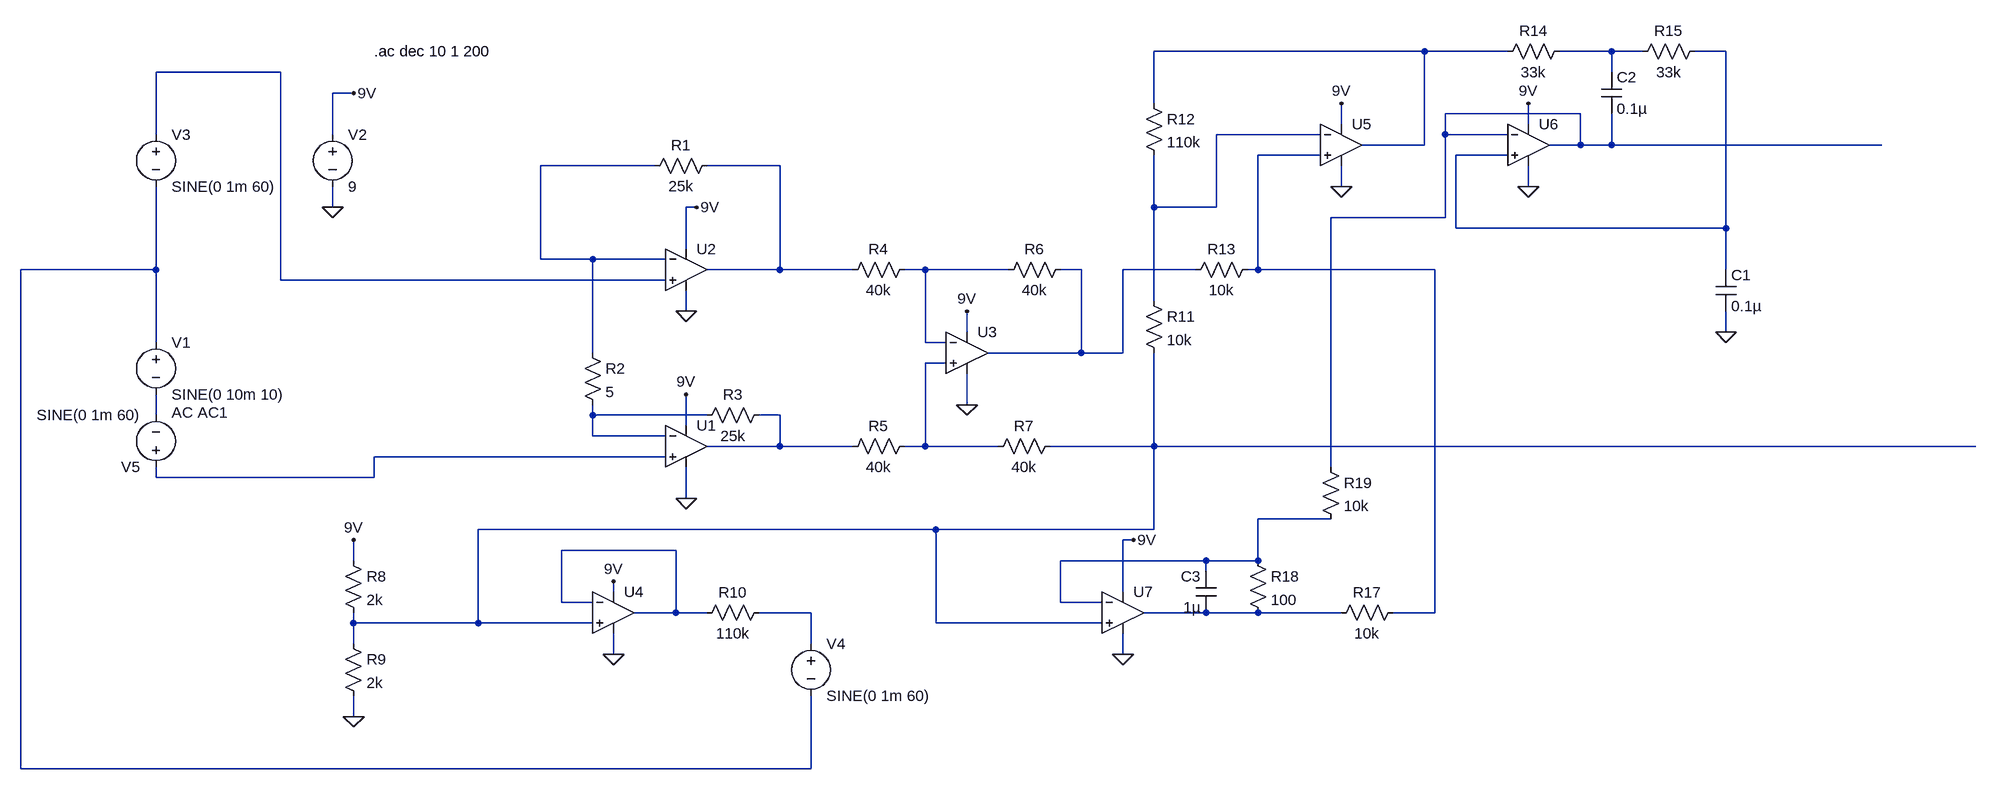
[diagram p0: schematic EEGSim.asc]
EEGSim.asc, the LTspice schematic file:
Version 4
SHEET 1 2068 868
WIRE 1216 -240 800 -240
WIRE 1344 -240 1216 -240
WIRE 1504 -240 1424 -240
WIRE 1552 -240 1504 -240
WIRE 1680 -240 1632 -240
WIRE -544 -208 -736 -208
WIRE 1504 -208 1504 -240
WIRE -432 -176 -464 -176
WIRE 800 -160 800 -240
WIRE 1456 -144 1248 -144
WIRE 1088 -128 1088 -160
WIRE 1376 -128 1376 -160
WIRE -736 -112 -736 -208
WIRE -464 -112 -464 -176
WIRE 1056 -112 896 -112
WIRE 1248 -112 1248 -144
WIRE 1344 -112 1248 -112
WIRE 1216 -96 1216 -240
WIRE 1216 -96 1120 -96
WIRE 1456 -96 1456 -144
WIRE 1456 -96 1408 -96
WIRE 1504 -96 1504 -144
WIRE 1504 -96 1456 -96
WIRE 1920 -96 1504 -96
WIRE 1056 -80 960 -80
WIRE 1344 -80 1264 -80
WIRE 32 -64 -144 -64
WIRE 224 -64 112 -64
WIRE 1088 -32 1088 -64
WIRE 1376 -32 1376 -64
WIRE -464 0 -464 -32
WIRE 96 0 80 0
WIRE 800 0 800 -80
WIRE 896 0 896 -112
WIRE 896 0 800 0
WIRE 1248 16 1248 -112
WIRE 1248 16 1072 16
WIRE 1264 32 1264 -80
WIRE 1680 32 1680 -240
WIRE 1680 32 1264 32
WIRE 80 64 80 0
WIRE -144 80 -144 -64
WIRE -64 80 -144 80
WIRE 48 80 -64 80
WIRE -736 96 -736 -32
WIRE -736 96 -944 96
WIRE 224 96 224 -64
WIRE 224 96 112 96
WIRE 336 96 224 96
WIRE 448 96 416 96
WIRE 576 96 448 96
WIRE 688 96 656 96
WIRE 864 96 752 96
WIRE 960 96 960 -80
WIRE 960 96 944 96
WIRE 1232 96 960 96
WIRE 1680 96 1680 32
WIRE -544 112 -544 -208
WIRE 48 112 -544 112
WIRE 800 144 800 0
WIRE 80 160 80 128
WIRE 512 192 512 160
WIRE 1680 192 1680 160
WIRE -736 208 -736 96
WIRE 448 208 448 96
WIRE 480 208 448 208
WIRE -64 224 -64 80
WIRE 688 224 688 96
WIRE 688 224 544 224
WIRE 752 224 752 96
WIRE 752 224 688 224
WIRE 480 240 448 240
WIRE 512 304 512 256
WIRE -736 320 -736 288
WIRE -64 320 -64 304
WIRE 112 320 -64 320
WIRE 224 320 192 320
WIRE 80 336 80 288
WIRE -64 352 -64 320
WIRE 48 352 -64 352
WIRE 224 368 224 320
WIRE 224 368 112 368
WIRE 336 368 224 368
WIRE 448 368 448 240
WIRE 448 368 416 368
WIRE 560 368 448 368
WIRE 800 368 800 224
WIRE 800 368 640 368
WIRE 2064 368 800 368
WIRE 48 384 -400 384
WIRE 1072 400 1072 16
WIRE -736 416 -736 400
WIRE -400 416 -400 384
WIRE -400 416 -736 416
WIRE 80 448 80 400
WIRE 1072 480 960 480
WIRE 464 496 -240 496
WIRE 800 496 800 368
WIRE 800 496 464 496
WIRE 768 512 752 512
WIRE 64 528 -112 528
WIRE -432 544 -432 512
WIRE 880 544 656 544
WIRE 960 544 960 480
WIRE 960 544 880 544
WIRE 880 560 880 544
WIRE -32 592 -32 576
WIRE 752 592 752 512
WIRE -112 608 -112 528
WIRE -64 608 -112 608
WIRE 656 608 656 544
WIRE 720 608 656 608
WIRE 64 624 64 528
WIRE 64 624 0 624
WIRE 112 624 64 624
WIRE 272 624 192 624
WIRE 880 624 784 624
WIRE 960 624 880 624
WIRE 1088 624 960 624
WIRE 1232 624 1232 96
WIRE 1232 624 1168 624
WIRE -432 640 -432 624
WIRE -240 640 -240 496
WIRE -240 640 -432 640
WIRE -64 640 -240 640
WIRE 464 640 464 496
WIRE 720 640 464 640
WIRE -432 672 -432 640
WIRE 272 672 272 624
WIRE -32 688 -32 656
WIRE 752 688 752 656
WIRE -432 784 -432 752
WIRE -944 864 -944 96
WIRE 272 864 272 752
WIRE 272 864 -944 864
FLAG -464 0 0
FLAG -432 -176 9V
FLAG 96 0 9V
FLAG 80 160 0
FLAG 80 448 0
FLAG 80 288 9V
FLAG 512 160 9V
FLAG 512 304 0
FLAG -32 576 9V
FLAG -32 688 0
FLAG -432 784 0
FLAG -432 512 9V
FLAG 1088 -32 0
FLAG 1088 -160 9V
FLAG 1376 -160 9V
FLAG 1376 -32 0
FLAG 1680 192 0
FLAG 752 688 0
FLAG 768 512 9V
SYMBOL voltage -736 192 R0
WINDOW 123 24 124 Left 2
WINDOW 39 0 0 Left 0
SYMATTR Value2 AC AC1
SYMATTR InstName V1
SYMATTR Value SINE(0 10m 10)
SYMBOL OpAmps\\UniversalOpAmp1 80 96 R0
SYMATTR InstName U2
SYMBOL voltage -464 -128 R0
WINDOW 123 0 0 Left 0
WINDOW 39 0 0 Left 0
SYMATTR InstName V2
SYMATTR Value 9
SYMBOL OpAmps\\UniversalOpAmp1 80 368 R0
SYMATTR InstName U1
SYMBOL res 128 -80 R90
WINDOW 0 0 56 VBottom 2
WINDOW 3 32 56 VTop 2
SYMATTR InstName R1
SYMATTR Value 25k
SYMBOL res -80 208 R0
SYMATTR InstName R2
SYMATTR Value 5
SYMBOL res 208 304 R90
WINDOW 0 0 56 VBottom 2
WINDOW 3 32 56 VTop 2
SYMATTR InstName R3
SYMATTR Value 25k
SYMBOL res 432 80 R90
WINDOW 0 0 56 VBottom 2
WINDOW 3 32 56 VTop 2
SYMATTR InstName R4
SYMATTR Value 40k
SYMBOL res 432 352 R90
WINDOW 0 0 56 VBottom 2
WINDOW 3 32 56 VTop 2
SYMATTR InstName R5
SYMATTR Value 40k
SYMBOL OpAmps\\UniversalOpAmp2 512 224 R0
SYMATTR InstName U3
SYMBOL res 672 80 R90
WINDOW 0 0 56 VBottom 2
WINDOW 3 32 56 VTop 2
SYMATTR InstName R6
SYMATTR Value 40k
SYMBOL res 656 352 R90
WINDOW 0 0 56 VBottom 2
WINDOW 3 32 56 VTop 2
SYMATTR InstName R7
SYMATTR Value 40k
SYMBOL OpAmps\\UniversalOpAmp2 -32 624 R0
SYMATTR InstName U4
SYMBOL res -448 528 R0
SYMATTR InstName R8
SYMATTR Value 2k
SYMBOL res -448 656 R0
SYMATTR InstName R9
SYMATTR Value 2k
SYMBOL voltage -736 -128 R0
WINDOW 123 0 0 Left 0
WINDOW 39 0 0 Left 0
SYMATTR InstName V3
SYMATTR Value SINE(0 1m 60)
SYMBOL res 208 608 R90
WINDOW 0 0 56 VBottom 2
WINDOW 3 32 56 VTop 2
SYMATTR InstName R10
SYMATTR Value 110k
SYMBOL res 784 128 R0
SYMATTR InstName R11
SYMATTR Value 10k
SYMBOL res 784 -176 R0
SYMATTR InstName R12
SYMATTR Value 110k
SYMBOL OpAmps\\UniversalOpAmp2 1088 -96 R0
SYMATTR InstName U5
SYMBOL res 960 80 R90
WINDOW 0 0 56 VBottom 2
WINDOW 3 32 56 VTop 2
SYMATTR InstName R13
SYMATTR Value 10k
SYMBOL res 1440 -256 R90
WINDOW 0 0 56 VBottom 2
WINDOW 3 32 56 VTop 2
SYMATTR InstName R14
SYMATTR Value 33k
SYMBOL OpAmps\\UniversalOpAmp2 1376 -96 R0
SYMATTR InstName U6
SYMBOL res 1648 -256 R90
WINDOW 0 0 56 VBottom 2
WINDOW 3 32 56 VTop 2
SYMATTR InstName R15
SYMATTR Value 33k
SYMBOL cap 1664 96 R0
SYMATTR InstName C1
SYMATTR Value 0.1µ
SYMBOL cap 1488 -208 R0
SYMATTR InstName C2
SYMATTR Value 0.1µ
SYMBOL OpAmps\\UniversalOpAmp2 752 624 R0
SYMATTR InstName U7
SYMBOL cap 896 624 R180
WINDOW 0 24 56 Left 2
WINDOW 3 24 8 Left 2
SYMATTR InstName C3
SYMATTR Value 1µ
SYMBOL res 944 528 R0
SYMATTR InstName R18
SYMATTR Value 100
SYMBOL res 1184 608 R90
WINDOW 0 0 56 VBottom 2
WINDOW 3 32 56 VTop 2
SYMATTR InstName R17
SYMATTR Value 10k
SYMBOL voltage 272 656 R0
WINDOW 123 0 0 Left 0
WINDOW 39 0 0 Left 0
SYMATTR InstName V4
SYMATTR Value SINE(0 1m 60)
SYMBOL res 1056 384 R0
SYMATTR InstName R19
SYMATTR Value 10k
SYMBOL voltage -736 416 R180
WINDOW 123 0 0 Left 0
WINDOW 39 0 0 Left 0
SYMATTR InstName V5
SYMATTR Value SINE(0 1m 60)
TEXT -400 -240 Left 2 !.ac dec 10 1 200

The netlist it stands for:
* EEGSim.asc
V1 N010 N014 SINE(0 10m 10) AC AC1
XU2 N004 N008 9V 0 N009 level1 Avol=1Meg GBW=10Meg Vos=0 En=0 Enk=0 In=0 Ink=0 Rin=500Meg  ; pins In+ In- V+ V- OUT
V2 9V 0 9
XU1 N018 N015 9V 0 N016 level1 Avol=1Meg GBW=10Meg Vos=0 En=0 Enk=0 In=0 Ink=0 Rin=500Meg  ; pins In+ In- V+ V- OUT
R1 N009 N008 25k
R2 N008 N015 5
R3 N016 N015 25k
R4 N011 N009 40k
R5 N013 N016 40k
XU3 N013 N011 9V 0 N012 level2 Avol=1Meg GBW=10Meg Slew=10Meg Ilimit=25m Rail=0 Vos=0 En=0 Enk=0 In=0 Ink=0 Rin=500Meg  ; pins In+ In- V+ V- OUT
R6 N012 N011 40k
R7 N017 N013 40k
XU4 N017 N020 9V 0 N020 level2 Avol=1Meg GBW=10Meg Slew=10Meg Ilimit=25m Rail=0 Vos=0 En=0 Enk=0 In=0 Ink=0 Rin=500Meg  ; pins In+ In- V+ V- OUT
R8 9V N017 2k
R9 N017 0 2k
V3 N004 N010 SINE(0 1m 60)
R10 N021 N020 110k
R11 N006 N017 10k
R12 N001 N006 110k
XU5 N007 N006 9V 0 N001 level2 Avol=1Meg GBW=10Meg Slew=10Meg Ilimit=25m Rail=0 Vos=0 En=0 Enk=0 In=0 Ink=0 Rin=500Meg  ; pins In+ In- V+ V- OUT
R13 N007 N012 10k
R14 N002 N001 33k
XU6 N003 N005 9V 0 N005 level2 Avol=1Meg GBW=10Meg Slew=10Meg Ilimit=25m Rail=0 Vos=0 En=0 Enk=0 In=0 Ink=0 Rin=500Meg  ; pins In+ In- V+ V- OUT
R15 N003 N002 33k
C1 N003 0 0.1µ
C2 N002 N005 0.1µ
XU7 N017 N019 9V 0 N022 level2 Avol=1Meg GBW=10Meg Slew=10Meg Ilimit=25m Rail=0 Vos=0 En=0 Enk=0 In=0 Ink=0 Rin=500Meg  ; pins In+ In- V+ V- OUT
C3 N022 N019 1µ
R18 N019 N022 100
R17 N007 N022 10k
V4 N021 N010 SINE(0 1m 60)
R19 N005 N019 10k
V5 N018 N014 SINE(0 1m 60)
.ac dec 10 1 200
.lib UniversalOpAmp1.lib
.lib UniversalOpAmp2.lib
.backanno
.end